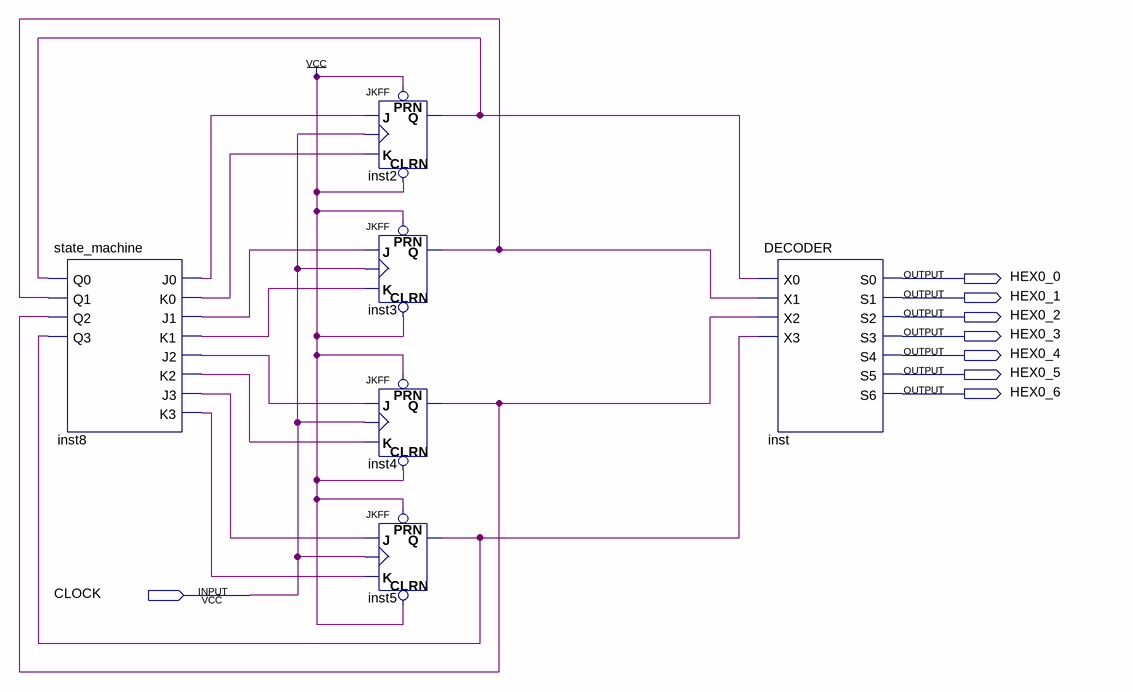
[diagram p0: schematic sheet]
// Quartus schematic lab4gate-level.bdf as structural Verilog: 6 symbols, 8 pins
module \lab4gate-level  (
  input  CLOCK,
  output HEX0_0,
  output HEX0_1,
  output HEX0_2,
  output HEX0_3,
  output HEX0_4,
  output HEX0_5,
  output HEX0_6
);

  wire inst2_q, inst3_q, inst4_q, inst5_q, inst8_j0, inst8_j1, inst8_j2, inst8_j3, inst8_k0, inst8_k1,
       inst8_k2, inst8_k3;

  state_machine inst8 (
    .Q0(inst2_q), .Q1(inst3_q), .Q2(inst4_q), .Q3(inst5_q), .J0(inst8_j0), .K0(inst8_k0), .J1(inst8_j1),
    .K1(inst8_k1), .J2(inst8_j2), .K2(inst8_k2), .J3(inst8_j3), .K3(inst8_k3));
  JKFF inst2 (.PRN(1'b1), .CLRN(1'b1), .K(inst8_k0), .J(inst8_j0), .CLK(CLOCK), .Q(inst2_q));
  JKFF inst3 (.PRN(1'b1), .CLRN(1'b1), .K(inst8_k1), .J(inst8_j1), .CLK(CLOCK), .Q(inst3_q));
  JKFF inst4 (.PRN(1'b1), .CLRN(1'b1), .K(inst8_k2), .J(inst8_j2), .CLK(CLOCK), .Q(inst4_q));
  JKFF inst5 (.PRN(1'b1), .CLRN(1'b1), .K(inst8_k3), .J(inst8_j3), .CLK(CLOCK), .Q(inst5_q));
  DECODER inst (
    .X0(inst2_q), .X1(inst3_q), .X2(inst4_q), .X3(inst5_q), .S0(HEX0_0), .S1(HEX0_1), .S2(HEX0_2),
    .S3(HEX0_3), .S4(HEX0_4), .S5(HEX0_5), .S6(HEX0_6));
endmodule
